# EAGLE design pio (EAGLE 9.0.1)
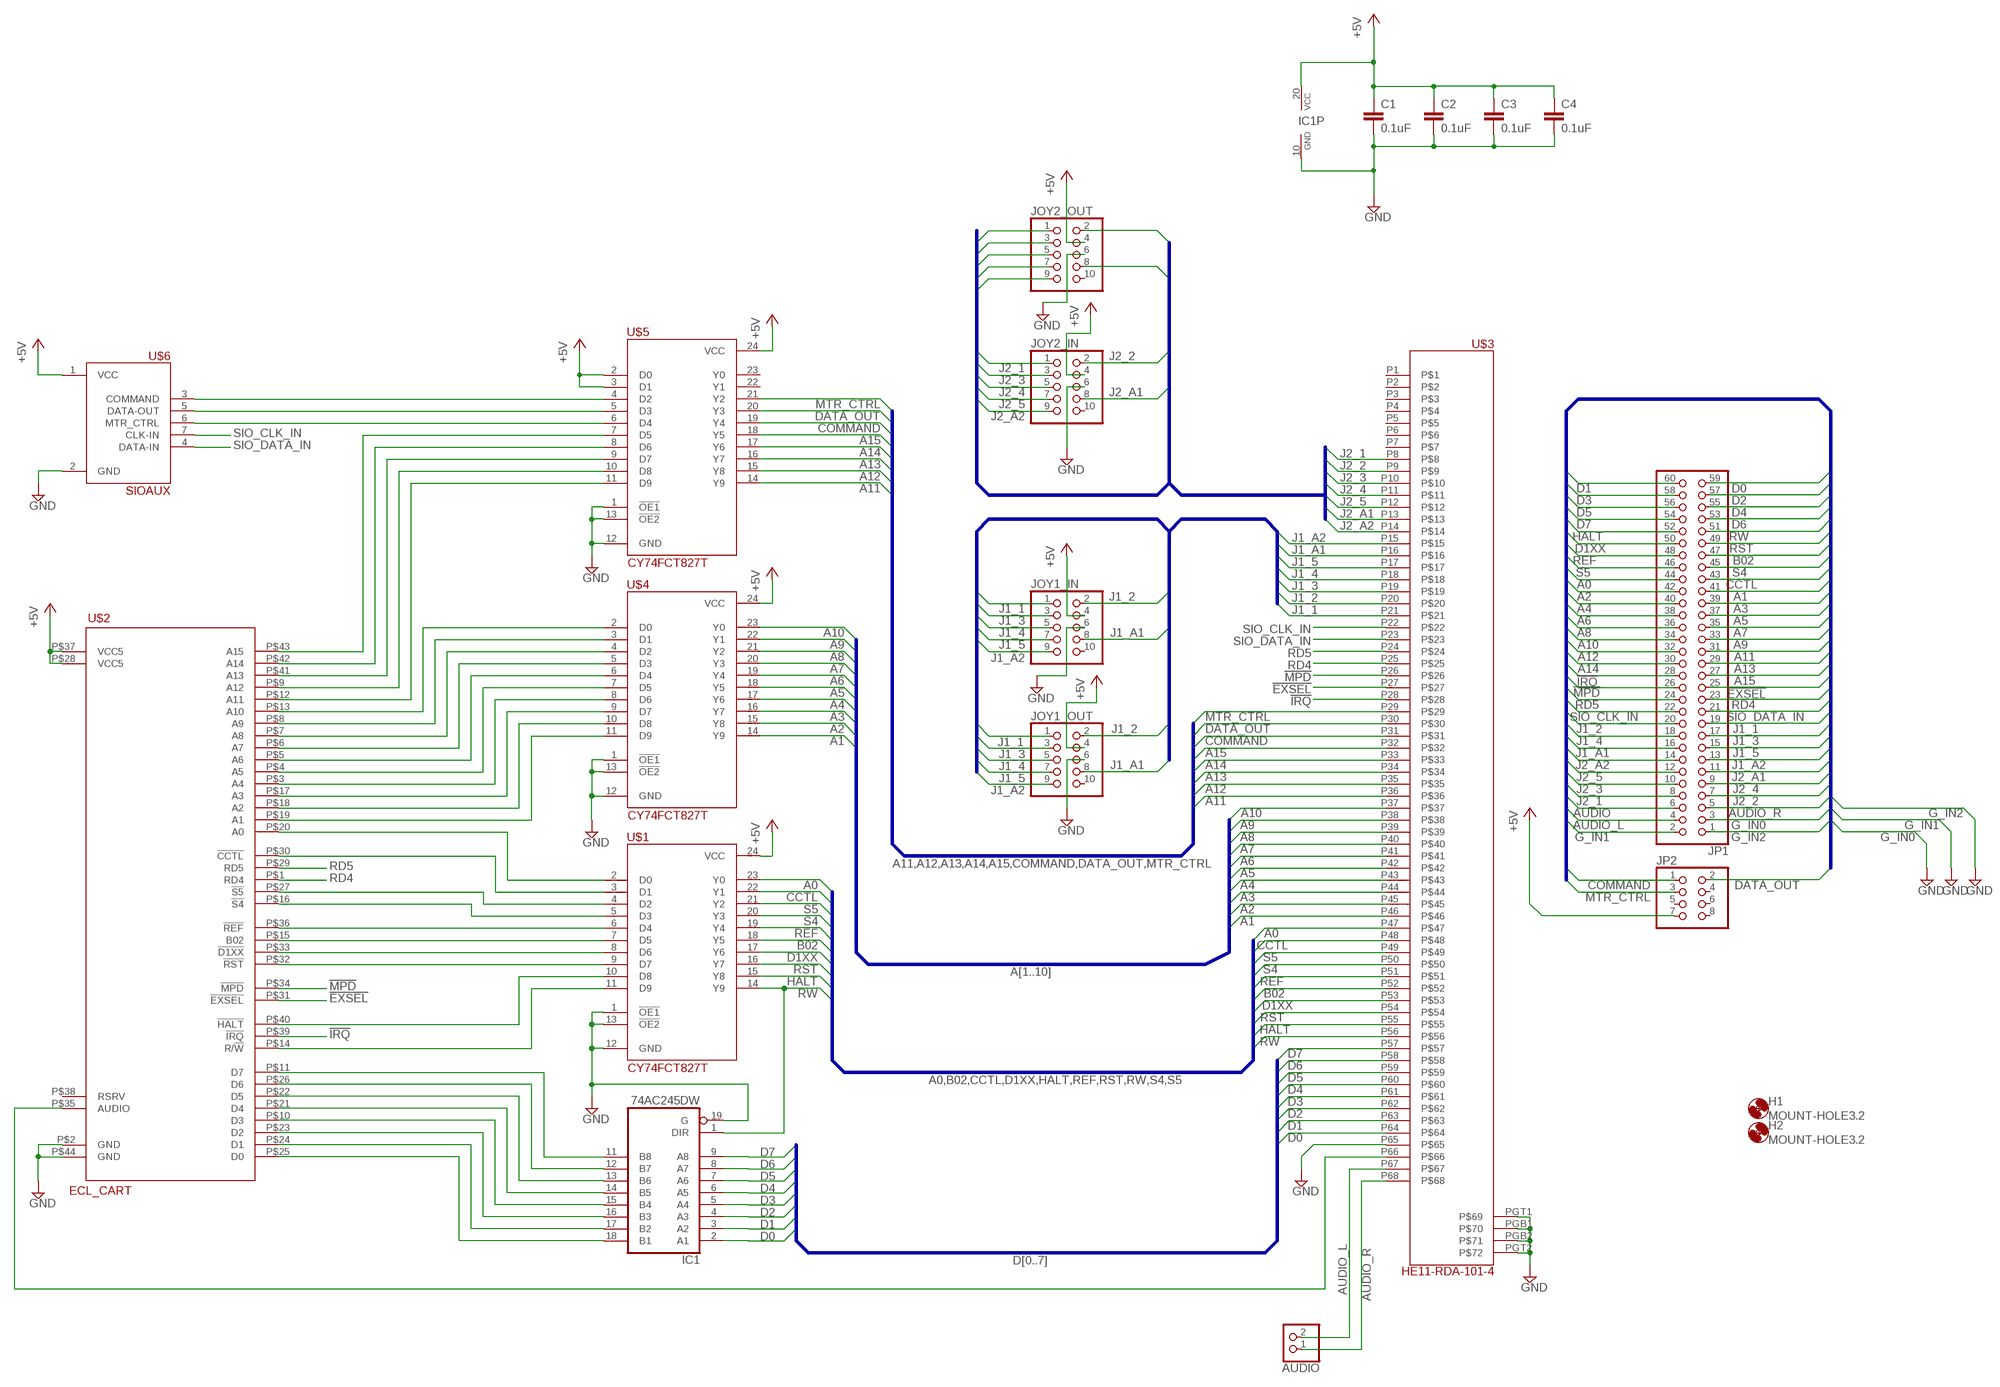
[diagram p0: schematic, sheet 1]

## Parts
AUDIO  PINHD-1X2  [1X02]
C1  0.1uF  C-EUC1206  [C1206]
C2  0.1uF  C-EUC1206  [C1206]
C3  0.1uF  C-EUC1206  [C1206]
C4  0.1uF  C-EUC1206  [C1206]
H1  MOUNT-HOLE3.2  [3,2]
H2  MOUNT-HOLE3.2  [3,2]
IC1  74AC245DW  [SO20W]
JOY1_IN  PINHD-2X5  [2X05]
JOY1_OUT  PINHD-2X5  [2X05]
JOY2_IN  PINHD-2X5  [2X05]
JOY2_OUT  PINHD-2X5  [2X05]
JP1  PINHD-2X30  [2X30]
JP2  PINHD-2X4  [2X04]
U$1  CY74FCT827T  [SO24L]
U$2  ECL_CART  [ECL_CART]
U$3  HE11-RDA-101-4  [HE11-RDA-101-4]
U$4  CY74FCT827T  [SO24L]
U$5  CY74FCT827T  [SO24L]
U$6  SIOAUX  [1X07]

## Nets
!EXSEL!: JP1.25 U$2.P$31(!EXSEL!) U$3.P27
!IRQ!: JP1.28 U$2.P$39(!IRQ!) U$3.P28
!MPD!: JP1.26 U$2.P$34(!MPD!) U$3.P26
+5V: C1.1 C2.1 C3.1 C4.1 IC1.20(VCC) JOY1_IN.4 JOY1_OUT.4 JOY2_IN.4 JOY2_OUT.4 JP2.7 U$1.24(VCC) U$2.P$28(VCC5) U$2.P$37(VCC5) U$4.24(VCC) U$5.2(D0) U$5.3(D1) U$5.24(VCC) U$6.1(VCC)
A0: JP1.44 U$1.23(Y0) U$3.P47
A1: JP1.41 U$3.P46 U$4.14(Y9)
A2: JP1.42 U$3.P45 U$4.15(Y8)
A3: JP1.39 U$3.P44 U$4.16(Y7)
A4: JP1.40 U$3.P43 U$4.17(Y6)
A5: JP1.37 U$3.P42 U$4.18(Y5)
A6: JP1.38 U$3.P41 U$4.19(Y4)
A7: JP1.35 U$3.P40 U$4.20(Y3)
A8: JP1.36 U$3.P39 U$4.21(Y2)
A9: JP1.33 U$3.P38 U$4.22(Y1)
A10: JP1.34 U$3.P37 U$4.23(Y0)
A11: JP1.31 U$3.P36 U$5.14(Y9)
A12: JP1.32 U$3.P35 U$5.15(Y8)
A13: JP1.29 U$3.P34 U$5.16(Y7)
A14: JP1.30 U$3.P33 U$5.17(Y6)
A15: JP1.27 U$3.P32 U$5.18(Y5)
AUDIO: JP1.6 U$2.P$35(AUDIO) U$3.P66
AUDIO_L: AUDIO.2 JP1.4 U$3.P67
AUDIO_R: AUDIO.1 JP1.5 U$3.P68
B02: JP1.47 U$1.18(Y5) U$3.P52
CCTL: JP1.43 U$1.22(Y1) U$3.P48
COMMAND: JP2.1 U$3.P31 U$5.19(Y4)
D0: IC1.2(A1) JP1.59 U$3.P64
D1: IC1.3(A2) JP1.60 U$3.P63
D1XX: JP1.50 U$1.17(Y6) U$3.P53
D2: IC1.4(A3) JP1.57 U$3.P62
D3: IC1.5(A4) JP1.58 U$3.P61
D4: IC1.6(A5) JP1.55 U$3.P60
D5: IC1.7(A6) JP1.56 U$3.P59
D6: IC1.8(A7) JP1.53 U$3.P58
D7: IC1.9(A8) JP1.54 U$3.P57
DATA_OUT: JP2.2 U$3.P30 U$5.20(Y3)
G_IN0: JP1.3 ; supply symbol labelled GND
G_IN1: JP1.2 ; supply symbol labelled GND
G_IN2: JP1.1 ; supply symbol labelled GND
GND: C1.2 C2.2 C3.2 C4.2 IC1.10(GND) IC1.19(G) JOY1_IN.6 JOY1_OUT.6 JOY2_IN.6 JOY2_OUT.6 U$1.1(!OE1!) U$1.12(GND) U$1.13(!OE2!) U$2.P$2(GND) U$2.P$44(GND) U$3.P65 U$3.PGB1 U$3.PGB2 U$3.PGT1 U$3.PGT2 U$4.1(!OE1!) U$4.12(GND) U$4.13(!OE2!) U$5.1(!OE1!) U$5.12(GND) U$5.13(!OE2!) U$6.2(GND)
HALT: JP1.52 U$1.15(Y8) U$3.P55
J1_1: JOY1_IN.1 JOY1_OUT.1 JP1.19 U$3.P21
J1_2: JOY1_IN.2 JOY1_OUT.2 JP1.20 U$3.P20
J1_3: JOY1_IN.3 JOY1_OUT.3 JP1.17 U$3.P19
J1_4: JOY1_IN.5 JOY1_OUT.5 JP1.18 U$3.P18
J1_5: JOY1_IN.7 JOY1_OUT.7 JP1.15 U$3.P17
J1_A1: JOY1_IN.8 JOY1_OUT.8 JP1.16 U$3.P16
J1_A2: JOY1_IN.9 JOY1_OUT.9 JP1.13 U$3.P15
J2_1: JOY2_IN.1 JOY2_OUT.1 JP1.8 U$3.P8
J2_2: JOY2_IN.2 JOY2_OUT.2 JP1.7 U$3.P9
J2_3: JOY2_IN.3 JOY2_OUT.3 JP1.10 U$3.P10
J2_4: JOY2_IN.5 JOY2_OUT.5 JP1.9 U$3.P11
J2_5: JOY2_IN.7 JOY2_OUT.7 JP1.12 U$3.P12
J2_A1: JOY2_IN.8 JOY2_OUT.8 JP1.11 U$3.P13
J2_A2: JOY2_IN.9 JOY2_OUT.9 JP1.14 U$3.P14
MTR_CTRL: JP2.3 U$3.P29 U$5.21(Y2)
N$1: U$1.11(D9) U$2.P$14(R/!W!)
N$3: U$1.10(D8) U$2.P$40(!HALT!)
N$4: U$1.9(D7) U$2.P$32(!RST!)
N$5: U$1.8(D6) U$2.P$33(!D1XX!)
N$6: U$1.7(D5) U$2.P$15(B02)
N$7: U$1.6(D4) U$2.P$36(!REF!)
N$8: U$1.5(D3) U$2.P$16(!S4!)
N$9: U$1.4(D2) U$2.P$27(!S5!)
N$10: U$1.3(D1) U$2.P$30(!CCTL!)
N$11: U$1.2(D0) U$2.P$20(A0)
N$22: U$2.P$19(A1) U$4.11(D9)
N$23: U$2.P$18(A2) U$4.10(D8)
N$24: U$2.P$17(A3) U$4.9(D7)
N$25: U$2.P$3(A4) U$4.8(D6)
N$26: U$2.P$4(A5) U$4.7(D5)
N$27: U$2.P$5(A6) U$4.6(D4)
N$28: U$2.P$6(A7) U$4.5(D3)
N$29: U$2.P$7(A8) U$4.4(D2)
N$30: U$2.P$8(A9) U$4.3(D1)
N$31: U$2.P$13(A10) U$4.2(D0)
N$42: U$5.6(D4) U$6.6(MTR_CTRL)
N$43: U$5.5(D3) U$6.5(DATA-OUT)
N$44: U$5.4(D2) U$6.3(COMMAND)
N$45: U$2.P$12(A11) U$5.11(D9)
N$46: U$2.P$9(A12) U$5.10(D8)
N$47: U$2.P$41(A13) U$5.9(D7)
N$48: U$2.P$42(A14) U$5.8(D6)
N$49: U$2.P$43(A15) U$5.7(D5)
N$67: IC1.11(B8) U$2.P$11(D7)
N$68: IC1.12(B7) U$2.P$26(D6)
N$69: IC1.13(B6) U$2.P$22(D5)
N$70: IC1.14(B5) U$2.P$21(D4)
N$71: IC1.15(B4) U$2.P$10(D3)
N$72: IC1.16(B3) U$2.P$23(D2)
N$73: IC1.17(B2) U$2.P$24(D1)
N$74: IC1.18(B1) U$2.P$25(D0)
RD4: JP1.23 U$2.P$1(RD4) U$3.P25
RD5: JP1.24 U$2.P$29(RD5) U$3.P24
REF: JP1.48 U$1.19(Y4) U$3.P51
RST: JP1.49 U$1.16(Y7) U$3.P54
RW: IC1.1(DIR) JP1.51 U$1.14(Y9) U$3.P56
S4: JP1.45 U$1.20(Y3) U$3.P50
S5: JP1.46 U$1.21(Y2) U$3.P49
SIO_CLK_IN: JP1.22 U$3.P22 U$6.7(CLK-IN)
SIO_DATA_IN: JP1.21 U$3.P23 U$6.4(DATA-IN)
Unconnected: JOY1_IN.10 JOY1_OUT.10 JOY2_IN.10 JOY2_OUT.10 JP2.4 JP2.5 JP2.6 JP2.8 U$2.P$38(RSRV) U$3.P1 U$3.P2 U$3.P3 U$3.P4 U$3.P5 U$3.P6 U$3.P7 U$5.22(Y1) U$5.23(Y0)

## Buses
D[0..7]
A0,B02,CCTL,D1XX,HALT,REF,RST,RW,S4,S5
A[1..10]
A11,A12,A13,A14,A15,COMMAND,DATA_OUT,MTR_CTRL
J1_1,J1_2,J1_3,J1_4,J1_5,J1_A1,J1_A2
J2_1,J2_2,J2_3,J2_4,J2_5,J2_A1,J2_A2
!EXSEL!,!IRQ!,!MPD!,+5V,A0,A1,A10,A11,A12,A13,A14,A15,A2,A3,A4,A5,A6,A7,A8,A9,AUDIO,AUDIO_L,AUDIO_R,B02,CCTL,COMMAND,D0,D1,D1XX,D2,D3,D4,D5,D6,D7,DATA_OUT,GND,G_IN0,G_IN1,G_IN2,G_OUT0,G_OUT1,G_OUT2,G_OUT3,HALT,J1_1,J1_2,J1_3,J1_4,J1_5,J1_A1,J1_A2,J2_1,J2_2,J2_3,J2_4,J2_5,J2_A1,J2_A2,MTR_CTRL,RD4,RD5,REF,RST,RW,S4,S5,SIO_CLK_IN,SIO_DATA_IN

## Library data of the parts
AUDIO = pinhead:PINHD-1X2: PIN HEADER
C1-C4 = rcl:C-EU: CAPACITOR, European symbol; SPICEPREFIX: C
H1 H2 = holes:MOUNT-HOLE: MOUNTING HOLE with drill center marker
IC1 = 74xx-eu:74*245: Octal BUS TRANSCEIVER, 3-state
JOY1_IN JOY1_OUT JOY2_IN JOY2_OUT = pinhead:PINHD-2X5: PIN HEADER
JP1 = pinhead:PINHD-2X30: PIN HEADER
JP2 = pinhead:PINHD-2X4: PIN HEADER
U$1 U$4 U$5 = sjg-logic:CY74FCT827T
U$2 = Atari:ECL_CART
U$3 = sjg-vhdci:HE11-RDA-101-4
U$6 = pbxl:SIOAUX

## Board
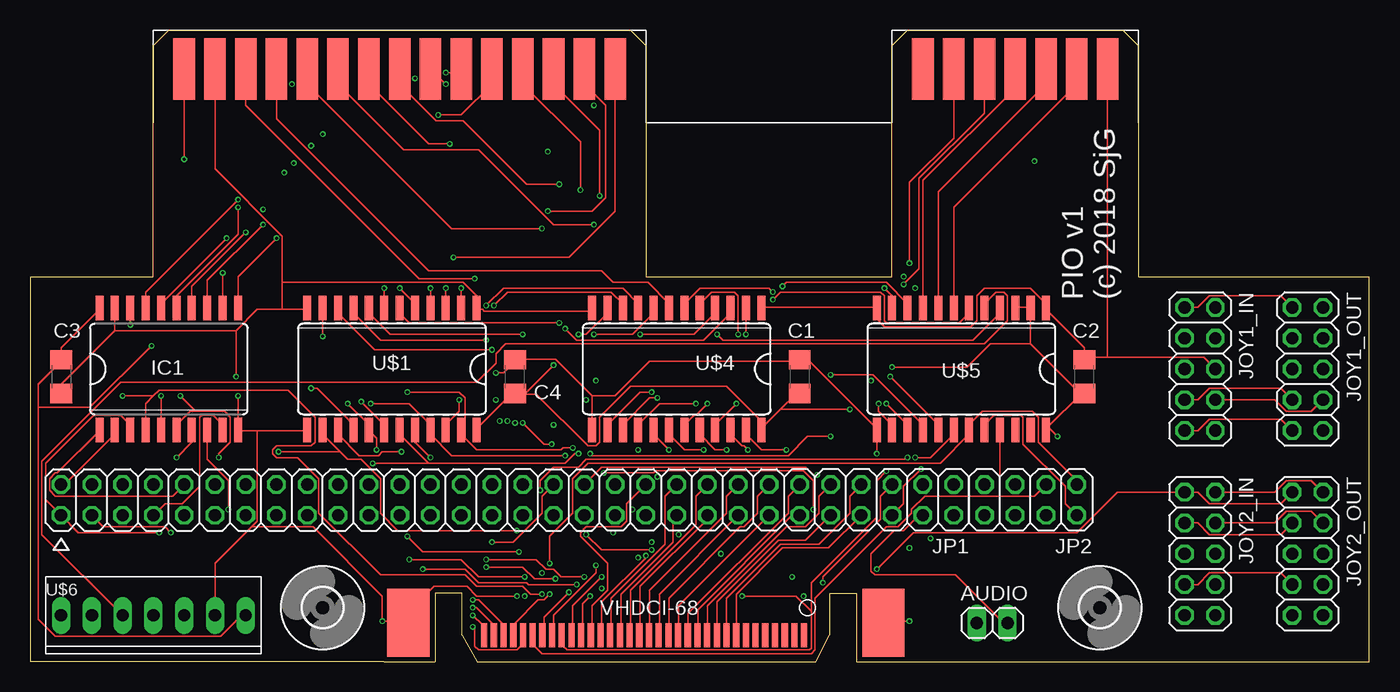
[diagram p1: board, top side]
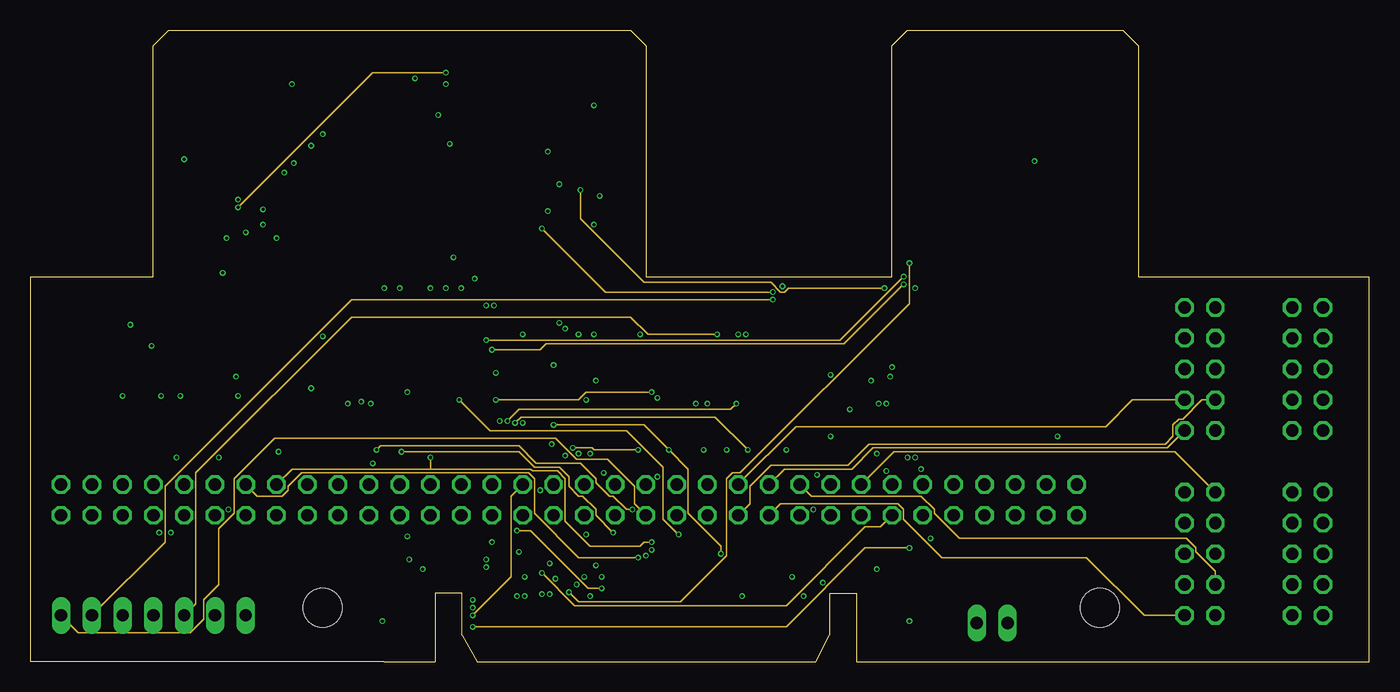
[diagram p2: board, inner layer Route2]
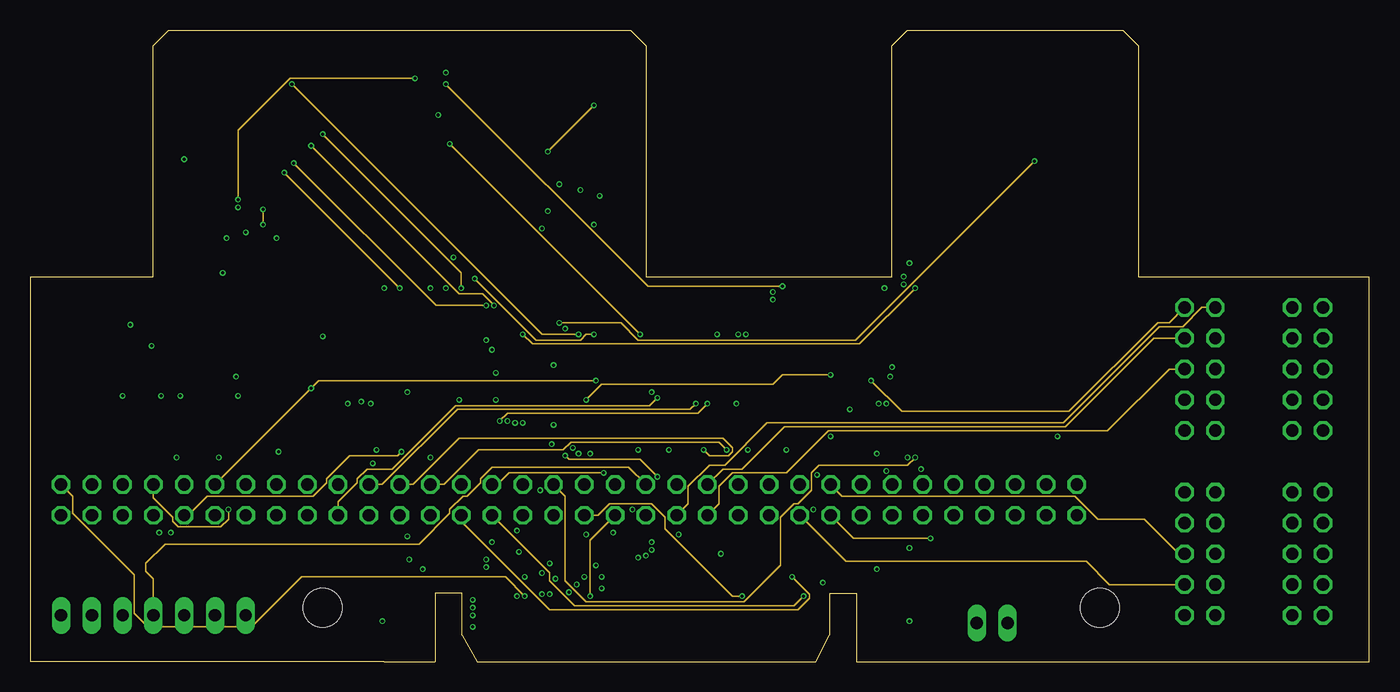
[diagram p3: board, inner layer Route15]
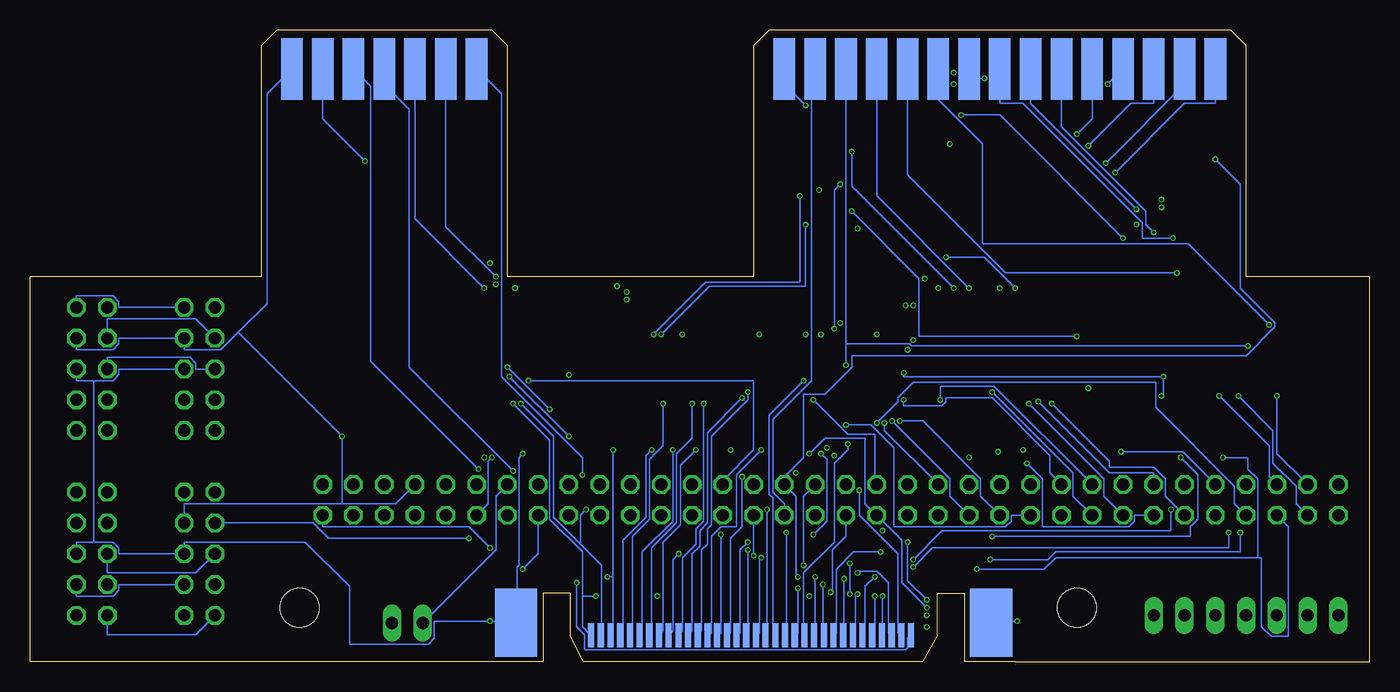
[diagram p4: board, bottom side, seen from below]

Size 110.49 x 52.07 mm. Coordinates in mm from the lower left corner, seen from the top.
Outline: 72.39,0 110.49,0 110.49,31.75 91.44,31.75 91.44,50.8 90.17,52.07 72.39,52.07 71.12,50.8 71.12,31.75 50.8,31.75 50.8,50.8 49.53,52.07 11.43,52.07 10.16,50.8 10.16,31.75 0,31.75 0,0 29.21,0
Copper layers (1*2*15*16): Top 0.035559375mm / dielectric 0.17018125mm / Route2 0.01778125mm / dielectric 47mil / Route15 0.01778125mm / dielectric 0.17018125mm / Bottom 0.035559375mm
Design rules "oshpark-4layer": minimum track width 5mil, minimum drill 10mil, track to track 5mil, track to pad 5mil, pad to pad 5mil, via to via 5mil, smd to smd 5mil, copper to edge 15mil, drill to drill 6mil, minimum pad ring 4mil, minimum via ring 4mil, stop-mask expansion 2.5mil, vias tented up to drill 0mil, thermal gap 10mil
vRestrict: area 36.8,2.5 to 64.8,5.1; area 35.6,0 to 66,2.5; area 5.1,17.1 to 17.8,21.6; area 4.4,28.6 to 17.8,31.8; area 22.2,27.3 to 36.8,30.5; area 22.2,17.8 to 37.5,21; area 45.7,17.8 to 61,21; area 45.1,27.3 to 61,30.5; area 69.2,17.8 to 84.5,21; area 69.2,27.3 to 84.5,30.5; area 85.7,20.3 to 88.9,26.7; area 62.2,20.3 to 65.4,26.7; 2 more areas

### Footprints (pad centres in the part's own frame; a part is rotated, then mirrored left to right if it is on the bottom)
1X02 = drill 1.016 long: 1 -1.27,0; 2 1.27,0
C1206 = smd 1.6 x 1.8: 1 -1.4,0; 2 1.4,0
3,2 = hole 3.2: 0,0
SO20W = smd 0.66 x 2.032: 1 -5.715,-5.029; 2 -4.445,-5.029; 3 -3.175,-5.029; 4 -1.905,-5.029; 5 -0.635,-5.029; 6 0.635,-5.029; 7 1.905,-5.029; 8 3.175,-5.029; 9 4.445,-5.029; 10 5.715,-5.029; 11 5.715,5.029; 12 4.445,5.029; 13 3.175,5.029; 14 1.905,5.029; 15 0.635,5.029; 16 -0.635,5.029; 17 -1.905,5.029; 18 -3.175,5.029; 19 -4.445,5.029; 20 -5.715,5.029
2X05 = drill 1.016 octagon: 1 -5.08,-1.27; 2 -5.08,1.27; 3 -2.54,-1.27; 4 -2.54,1.27; 5 0,-1.27; 6 0,1.27; 7 2.54,-1.27; 8 2.54,1.27; 9 5.08,-1.27; 10 5.08,1.27
2X30 = drill 1.016 octagon: 1 -38.1,-1.27; 2 -38.1,1.27; 3 -35.56,-1.27; 4 -35.56,1.27; 5 -33.02,-1.27; 6 -33.02,1.27; 7 -30.48,-1.27; 8 -30.48,1.27; 9 -27.94,-1.27; 10 -27.94,1.27; 11 -25.4,-1.27; 12 -25.4,1.27; 13 -22.86,-1.27; 14 -22.86,1.27; 15 -20.32,-1.27; 16 -20.32,1.27; 17 -17.78,-1.27; 18 -17.78,1.27; 19 -15.24,-1.27; 20 -15.24,1.27; 21 -12.7,-1.27; 22 -12.7,1.27; 23 -10.16,-1.27; 24 -10.16,1.27; 25 -7.62,-1.27; 26 -7.62,1.27; 27 -5.08,-1.27; 28 -5.08,1.27; 29 -2.54,-1.27; 30 -2.54,1.27; 31 0,-1.27; 32 0,1.27; 33 2.54,-1.27; 34 2.54,1.27; 35 5.08,-1.27; 36 5.08,1.27; 37 7.62,-1.27; 38 7.62,1.27; 39 10.16,-1.27; 40 10.16,1.27; 41 12.7,-1.27; 42 12.7,1.27; 43 15.24,-1.27; 44 15.24,1.27; 45 17.78,-1.27; 46 17.78,1.27; 47 20.32,-1.27; 48 20.32,1.27; 49 22.86,-1.27; 50 22.86,1.27; 51 25.4,-1.27; 52 25.4,1.27; 53 27.94,-1.27; 54 27.94,1.27; 55 30.48,-1.27; 56 30.48,1.27; 57 33.02,-1.27; 58 33.02,1.27; 59 35.56,-1.27; 60 35.56,1.27
2X04 = drill 1.016 octagon: 1 -3.81,-1.27; 2 -3.81,1.27; 3 -1.27,-1.27; 4 -1.27,1.27; 5 1.27,-1.27; 6 1.27,1.27; 7 3.81,-1.27; 8 3.81,1.27
SO24L = smd 0.66 x 2.032: 1 -6.985,-5.029; 2 -5.715,-5.029; 3 -4.445,-5.029; 4 -3.175,-5.029; 5 -1.905,-5.029; 6 -0.635,-5.029; 7 0.635,-5.029; 8 1.905,-5.029; 9 3.175,-5.029; 10 4.445,-5.029; 11 5.715,-5.029; 12 6.985,-5.029; 13 6.985,5.029; 14 5.715,5.029; 15 4.445,5.029; 16 3.175,5.029; 17 1.905,5.029; 18 0.635,5.029; 19 -0.635,5.029; 20 -1.905,5.029; 21 -3.175,5.029; 22 -4.445,5.029; 23 -5.715,5.029; 24 -6.985,5.029
ECL_CART = smd 1.778 x 5.08: P$1 2.54,4.445; P$2 5.08,4.445; P$3 7.62,4.445; P$4 10.16,4.445; P$5 12.7,4.445; P$6 15.24,4.445; P$7 17.78,4.445; P$8 20.32,4.445; P$9 22.86,4.445; P$10 25.4,4.445; P$11 27.94,4.445; P$12 30.48,4.445; P$13 33.02,4.445; P$14 35.56,4.445; P$15 38.1,4.445; P$38 63.5,4.445; P$39 66.04,4.445; P$40 68.58,4.445; P$41 71.12,4.445; P$42 73.66,4.445; P$43 76.2,4.445; P$44 78.74,4.445 | smd 1.778 x 5.08 bottom: P$16 2.54,4.445; P$17 5.08,4.445; P$18 7.62,4.445; P$19 10.16,4.445; P$20 12.7,4.445; P$21 15.24,4.445; P$22 17.78,4.445; P$23 20.32,4.445; P$24 22.86,4.445; P$25 25.4,4.445; P$26 27.94,4.445; P$27 30.48,4.445; P$28 33.02,4.445; P$29 35.56,4.445; P$30 38.1,4.445; P$31 63.5,4.445; P$32 66.04,4.445; P$33 68.58,4.445; P$34 71.12,4.445; P$35 73.66,4.445; P$36 76.2,4.445; P$37 78.74,4.445
HE11-RDA-101-4 = smd 0.508 x 2.007: P1 13.054,2.17; P2 12.254,2.17; P3 11.454,2.17; P4 10.654,2.17; P5 9.854,2.17; P6 9.054,2.17; P7 8.254,2.17; P8 7.454,2.17; P9 6.654,2.17; P10 5.854,2.17; P11 5.054,2.17; P12 4.254,2.17; P13 3.454,2.17; P14 2.654,2.17; P15 1.854,2.17; P16 1.054,2.17; P17 0.254,2.17; P18 -0.546,2.17; P19 -1.346,2.17; P20 -2.146,2.17; P21 -2.946,2.17; P22 -3.746,2.17; P23 -4.546,2.17; P24 -5.346,2.17; P25 -6.146,2.17; P26 -6.946,2.17; P27 -7.746,2.17; P28 -8.546,2.17; P29 -9.346,2.17; P30 -10.146,2.17; P31 -10.946,2.17; P32 -11.746,2.17; P33 -12.546,2.17; P34 -13.346,2.17 | smd 0.508 x 2.007 bottom: P35 13.409,2.17; P36 12.609,2.17; P37 11.809,2.17; P38 11.009,2.17; P39 10.209,2.17; P40 9.409,2.17; P41 8.609,2.17; P42 7.809,2.17; P43 7.009,2.17; P44 6.209,2.17; P45 5.409,2.17; P46 4.609,2.17; P47 3.809,2.17; P48 3.009,2.17; P49 2.209,2.17; P50 1.409,2.17; P51 0.609,2.17; P52 -0.191,2.17; P53 -0.991,2.17; P54 -1.791,2.17; P55 -2.591,2.17; P56 -3.391,2.17; P57 -4.191,2.17; P58 -4.991,2.17; P59 -5.791,2.17; P60 -6.591,2.17; P61 -7.391,2.17; P62 -8.191,2.17; P63 -8.991,2.17; P64 -9.791,2.17; P65 -10.591,2.17; P66 -11.391,2.17; P67 -12.191,2.17; P68 -12.991,2.17 | smd 3.48 x 5.639 bottom: PGB1 19.6,3.2; PGB2 -19.6,3.2 | smd 3.48 x 5.639: PGT1 19.6,3.2; PGT2 -19.6,3.2
1X07 = drill 1.016 long: 1 -7.62,0; 2 -5.08,0; 3 -2.54,0; 4 0,0; 5 2.54,0; 6 5.08,0; 7 7.62,0

### Placement (x,y rotation side)
AUDIO  79.38,3.17 0 top
C1  63.5,23.5 90 top
C2  87,23.5 90 top
C3  2.54,23.5 270 top
C4  40.01,23.5 90 top
H1  88.27,4.45 90 top
H2  24.13,4.45 90 top
IC1  11.43,24.13 0 top
JOY1_IN  96.52,24.13 270 top
JOY1_OUT  105.41,24.13 270 top
JOY2_IN  96.52,8.89 270 top
JOY2_OUT  105.41,8.89 270 top
JP1  38.1,13.34 180 top
JP2  82.55,13.34 180 top
U$1  29.84,24.13 180 top
U$2  10.16,44.45 0 top
U$3  50.8,0 0 top
U$4  53.34,24.13 180 top
U$5  76.83,24.13 180 top
U$6  10.16,3.81 180 top

### Tracks (layer width: path | path; a pad name or v marks a point on that pad's centre or on a via)
!EXSEL!  (via drill 0.25)
  Top 0.127: v46.67,7.94 46.67,7.3 43.18,3.81 43.18,2.22 U$3.P27 | v64.93,15.4 64.61,15.4 63.98,16.03 47.15,16.03 JP1.25
  Bottom 0.127: v46.67,7.94 46.67,13.65 JP1.25 | U$2.P$31 71.6,46.83 71.6,23.5 64.93,16.83 v64.93,15.4
!IRQ!  (via drill 0.25)
  Top 0.127: v44.45,5.71 42.39,3.65 42.39,2.22 U$3.P28 | U$2.P$39 76.2,43.18 72.55,39.53 v72.55,32.86
  Route2 0.127: v72.55,32.86 72.55,29.53 58.58,15.56 57.94,15.56 57.47,15.08 57.47,8.73 53.66,4.92 45.24,4.92 v44.45,5.71
  Bottom 0.127: v44.45,5.71 44.29,5.87 44.29,9.21 43.18,10.32 JP1.28
!MPD!  (via drill 0.25)
  Top 0.127: 64.45,4.13 64.45,6.51 69.85,11.91 69.85,14.92 v70.64,15.72 | 64.45,4.13 64.45,1.11 64.29,0.95 44.29,0.95 43.97,1.27 43.97,2.06 U$3.P26 | v58.74,5.4 63.18,5.4 64.45,4.13
  Route15 0.127: JP1.26 46.83,12.06 47.78,13.02 51.28,13.02 52.39,11.91 52.39,10.95 57.94,5.4 v58.74,5.4
  Bottom 0.127: v70.64,15.72 79.22,24.29 79.22,45.56 81.28,47.62 U$2.P$34
+5V  (via drill 0.25)
  Top 0.127: U$5.3 81.28,29.21 82.55,29.21 U$5.2 82.55,29.05 82.55,26.19 | 86.68,22.07 87,22.07 C2.1 86.68,22.07 | 83.98,19.37 83.82,19.21 U$5.24 83.98,19.37 | 83.98,19.37 86.68,22.07 | 86.68,22.07 82.55,26.19 | JOY2_IN.4 102.71,11.43 103.66,12.38 105.73,12.38 JOY2_OUT.4 | v84.77,18.57 83.98,19.37 | IC1.20 5.71,29.05 2.54,25.88 2.54,24.92 C3.1 2.54,24.77 0.64,22.86 0.64,20.95 | U$6.1 17.46,3.81 15.72,2.06 2.06,2.06 0.64,3.49 0.64,20.95 | 40.01,22.07 39.69,22.07 36.83,19.21 U$1.24 | 40.01,22.07 C4.1 | 60.64,19.53 60.33,19.21 U$4.24 60.64,19.53 | 60.64,19.53 61.91,20.8 | 61.91,20.8 63.18,22.07 63.5,22.07 C1.1 | 40.8,22.07 41.75,22.07 46.04,17.78 46.67,17.78 46.99,18.1 46.99,20.16 49.53,22.7 57.47,22.7 60.64,19.53 | 40.8,22.07 40.01,22.07 | 40.01,22.07 C4.1 | 40.8,22.07 v43.18,24.45 | 40.8,22.07 C4.1 | 0.64,20.95 4.92,20.95 v10,26.04 | 82.55,26.19 79.22,26.19 77.31,24.29 v71.12,24.29 | 61.91,20.8 v67.63,20.8
  Bottom 0.127: JOY1_OUT.4 106.68,25.72 103.66,25.72 103.19,26.19 103.19,26.67 JOY1_IN.4 97.79,25.72 94.77,25.72 93.34,27.15 | U$2.P$37 90.96,46.83 90.96,29.53 93.34,27.15 | JP2.7 80.33,13.02 84.77,13.02 | 84.77,13.02 97.79,13.02 JOY2_IN.4 | 84.77,13.02 v84.77,18.57 93.34,27.15 | v43.18,24.45 43.18,26.19 | 43.18,26.19 U$2.P$28 | v10,26.04 37.78,26.04 37.94,26.19 43.18,26.19 | v67.63,20.8 v71.12,24.29
A0  (via drill 0.25)
  Top 0.127: v44.77,17.62 43.97,17.62 43.81,17.46 36.83,17.46 35.88,18.41 | 35.88,18.41 35.56,18.73 35.56,19.05 U$1.23 35.88,18.41 | v31.11,22.23 35.4,22.23 35.88,21.75 35.88,18.41
  Route2 0.127: v50.16,17.46 46.51,17.46 46.35,17.62 v44.77,17.62
  Bottom 0.127: v50.16,17.46 52.23,15.4 52.23,11.11 53.5,11.11 54.29,10.32 54.29,2.38 54.45,2.22 U$3.P47 | JP1.44 24.45,13.65 24.45,15.56 v31.11,22.23
A1  (via drill 0.25)
  Top 0.127: v51.28,22.23 50.32,22.23 47.62,19.53 47.62,19.21 U$4.14
  Route2 0.127: v38.42,21.59 45.24,21.59 45.88,22.23 v51.28,22.23
  Bottom 0.127: v51.28,22.23 51.28,21.59 54.29,18.57 54.29,11.27 54.61,10.95 54.61,9.68 55.09,9.21 55.09,2.54 55.4,2.22 U$3.P46 | JP1.41 26.35,15.56 26.35,16.99 31.11,21.75 34.92,21.75 34.92,21.43 35.24,21.11 38.42,21.11 v38.42,21.59
A2  (via drill 0.25)
  Top 0.127: v51.75,21.75 51.12,21.75 48.9,19.53 48.9,19.21 U$4.15
  Route15 0.127: JP1.42 25.4,13.18 26.99,14.76 26.99,15.08 27.78,15.88 29.84,15.88 35.08,21.11 51.12,21.11 v51.75,21.75
  Bottom 0.127: v51.75,21.75 54.61,18.89 54.61,11.43 55.24,10.79 55.24,9.53 55.88,8.89 55.88,2.54 56.2,2.22 U$3.P45
A3  (via drill 0.25)
  Top 0.127: v54.93,21.27 51.91,21.27 50.16,19.53 50.16,19.21 U$4.16
  Route15 0.127: JP1.39 29.05,14.61 35.24,20.8 54.45,20.8 v54.93,21.27
  Bottom 0.127: v54.93,21.27 54.93,11.59 55.56,10.95 55.56,9.68 56.67,8.57 56.67,2.54 56.99,2.22 U$3.P44
A4  (via drill 0.25)
  Top 0.127: v52.7,17.46 51.44,18.73 51.44,19.05 U$4.17
  Route2 0.127: v56.99,8.89 56.99,9.53 54.29,12.22 54.29,15.88 v52.7,17.46 50.64,19.53 v43.18,19.53
  Bottom 0.127: v56.99,8.89 57.47,8.41 57.47,2.54 57.78,2.22 U$3.P43 | JP1.40 29.53,12.06 29.53,11.59 30,11.11 39.21,11.11 39.21,17.62 41.12,19.53 v43.18,19.53
A5  (via drill 0.25)
  Top 0.127: v55.56,17.46 53.98,17.46 52.7,18.73 52.7,19.05 U$4.18
  Route15 0.127: JP1.37 31.59,14.61 35.4,18.41 57.15,18.41 57.94,17.62 57.94,17.3 57.63,16.99 56.04,16.99 v55.56,17.46
  Bottom 0.127: v55.56,17.46 56.83,16.19 56.83,11.27 58.26,9.84 58.26,2.54 58.58,2.22 U$3.P42
A6  (via drill 0.25)
  Top 0.127: v55.88,21.27 54.93,20.32 54.77,20.32 53.98,19.53 53.98,19.21 U$4.19
  Route15 0.127: v38.73,19.84 39.37,20.48 55.09,20.48 v55.88,21.27
  Bottom 0.127: v55.88,21.27 55.88,18.41 57.15,17.14 57.15,11.43 59.21,9.37 59.21,2.38 59.37,2.22 U$3.P41 | JP1.38 32.07,13.65 32.07,15.08 36.83,19.84 v38.73,19.84
A7  (via drill 0.25)
  Top 0.127: v57.47,17.46 56.52,17.46 55.24,18.73 55.24,19.05 U$4.20
  Route15 0.127: JP1.35 34.13,14.61 36.99,17.46 43.97,17.46 44.61,18.1 56.83,18.1 v57.47,17.46
  Bottom 0.127: v57.47,17.46 57.47,11.59 60.01,9.05 60.01,2.38 60.17,2.22 U$3.P40
A8  (via drill 0.25)
  Top 0.127: v58.26,21.27 56.52,19.53 56.52,19.21 U$4.21
  Route2 0.127: v39.37,19.84 40.32,20.8 57.78,20.8 v58.26,21.27
  Bottom 0.127: v58.26,21.27 58.26,17.78 59.37,16.67 59.37,11.75 60.8,10.32 60.8,2.38 60.96,2.22 U$3.P39 | JP1.36 34.61,13.65 34.61,15.08 v39.37,19.84
A9  (via drill 0.25)
  Top 0.127: v59.21,17.46 58.9,17.78 58.74,17.78 57.78,18.73 57.78,19.05 U$4.22
  Route2 0.127: v40.01,19.68 40.48,20.16 56.52,20.16 v59.21,17.46
  Bottom 0.127: v59.21,17.46 59.69,16.99 59.69,11.91 61.59,10 61.59,2.38 61.75,2.22 U$3.P38 | JP1.33 40.01,19.05 v40.01,19.68
A10  (via drill 0.25)
  Top 0.127: v62.39,17.46 60.33,17.46 59.05,18.73 59.05,19.05 U$4.23
  Route15 0.127: JP1.34 35.56,11.59 42.86,4.29 63.34,4.29 64.29,5.24 64.29,5.56 v62.87,6.99
  Bottom 0.127: v62.39,17.46 62.39,6.99 | 62.39,6.99 62.39,2.38 62.55,2.22 U$3.P37 | 62.39,6.99 v62.87,6.99
A11  (via drill 0.25)
  Top 0.127: v70.01,21.27 70.01,20.64 71.12,19.53 71.12,19.21 U$5.14 | v47.31,15.56 51.44,15.56 51.59,15.72 63.82,15.72 64.61,14.92 v64.61,12.54
  Route15 0.127: JP1.31 38.58,14.61 39.53,15.56 v47.31,15.56
  Bottom 0.127: 65.09,9.68 67.31,11.91 67.31,18.57 v70.01,21.27 | 65.09,9.68 63.34,7.94 63.34,2.22 U$3.P36 | v64.61,12.54 65.09,12.06 65.09,9.68
A12  (via drill 0.25)
  Top 0.127: v70.64,21.27 72.39,19.53 72.39,19.21 U$5.15
  Route15 0.127: JP1.32 42.86,7.3 42.86,6.67 44.93,4.6 63.02,4.6 v63.82,5.4
  Bottom 0.127: 64.93,5.4 64.93,9.05 67.63,11.75 67.63,18.26 v70.64,21.27 | 64.93,5.4 64.93,2.86 64.29,2.22 U$3.P35 | 64.93,5.4 v63.82,5.4
A13  (via drill 0.25)
  Top 0.127: v36.51,3.81 37.31,3.02 37.31,2.22 U$3.P34 | v66.04,23.65 69.53,23.65 73.66,19.53 73.66,19.21 U$5.16
  Route2 0.127: v36.51,3.81 39.69,6.99 39.69,13.65 JP1.29
  Route15 0.127: v66.04,23.65 62.07,23.65 61.28,22.86 47.15,22.86 v45.88,21.59
  Bottom 0.127: v45.88,21.59 43.02,18.73 40.8,18.73 40.8,14.76 JP1.29
A14  (via drill 0.25)
  Top 0.127: v36.51,4.45 36.83,4.45 38.1,3.17 38.1,2.22 U$3.P33 | v70.96,23.5 74.93,19.53 74.93,19.21 U$5.17 | v66.04,18.57 64.14,18.57 62.55,16.99 46.35,16.99 v46.2,17.14
  Bottom 0.127: v36.51,4.45 38.58,6.51 38.58,10 JP1.30 41.59,13.02 41.59,18.41 44.93,18.41 v46.2,17.14 | v66.04,18.57 v70.96,23.5
A15  (via drill 0.25)
  Top 0.127: v36.51,5.08 36.99,5.08 39.05,3.02 39.05,2.22 U$3.P32 | v38.1,9.84 39.85,9.84 42.23,12.22 42.23,13.65 JP1.27 | v73.03,16.83 74.3,16.83 76.2,18.73 76.2,19.05 U$5.18
  Route15 0.127: v73.03,16.83 72.39,16.19 65.09,16.19 64.45,15.56 64.45,14.13 63.34,13.02 63.02,13.02 61.91,11.91 61.91,7.94 58.9,4.92 45.88,4.92 44.13,6.67 44.13,13.65 JP1.27
  Bottom 0.127: v36.51,5.08 38.1,6.67 v38.1,9.84
AUDIO  (via drill 0.25)
  Top 0.127: v73.5,15.88 72.07,14.45 72.07,13.02 JP1.6
  Route2 0.127: v42.23,7.3 44.93,4.6 62.39,4.6 68.9,11.11 70.17,11.11 JP1.6
  Bottom 0.127: v42.23,7.3 42.23,7.46 40.64,7.46 39.69,6.51 39.69,2.38 39.53,2.22 U$3.P66 | U$2.P$35 82.39,47.47 82.39,24.77 v73.5,15.88
AUDIO_L  (via drill 0.25)
  Top 0.127: v42.07,14.13 42.07,14.92 43.18,16.03 45.24,16.03 45.88,16.67 72.23,16.67 v72.39,16.83 | AUDIO.2 80.33,3.17 76.36,7.14 69.69,7.14 69.37,7.46 69.37,8.89 71.28,10.79 72.07,10.79 73.34,12.06 JP1.4
  Bottom 0.127: v42.07,14.13 42.07,12.06 38.89,8.89 38.89,2.38 38.73,2.22 U$3.P67 | v72.39,16.83 72.71,16.51 72.71,13.02 JP1.4
AUDIO_R  (via drill 0.25)
  Top 0.127: v65.41,6.51 65.41,6.99 70.17,11.75 70.17,13.65 JP1.5
  Bottom 0.127: v65.41,6.51 65.41,2.86 64.77,2.22 64.77,0.95 38.26,0.95 38.1,1.11 38.1,1.91 37.94,2.06 U$3.P68 | AUDIO.1 72.07,9.21 72.07,13.65 JP1.5
B02  (via drill 0.25)
  Top 0.127: v27.3,21.43 29.21,19.53 29.21,19.21 U$1.18
  Route2 0.127: v50.16,8.57 45.24,8.57 41.59,12.22 41.59,15.08 41.12,15.56 22.38,15.56 21.27,14.45 21.27,14.13 20.8,13.65 18.73,13.65 JP1.47
  Bottom 0.127: v50.16,8.57 50.32,8.41 50.32,2.38 50.48,2.22 U$3.P52 | v27.3,21.43 21.43,15.56 17.78,15.56 JP1.47
CCTL  (via drill 0.25)
  Top 0.127: v35.4,21.59 35.4,20.64 34.29,19.53 34.29,19.21 U$1.22
  Route2 0.127: v53.5,10.48 52.23,11.75 52.23,16.03 49.21,19.05 37.94,19.05 v35.4,21.59
  Bottom 0.127: v53.5,10.48 53.5,2.38 53.66,2.22 U$3.P48 | JP1.43 30.96,22.7 35.4,22.7 v35.4,21.59
COMMAND  (via drill 0.25)
  Top 0.127: v42.86,5.56 42.39,5.08 41.91,5.08 40.01,3.17 40.01,2.22 U$3.P31 | v42.86,8.1 42.86,10.32 44.77,12.22 44.77,15.08 46.04,16.35 75.09,16.35 77.47,18.73 77.47,19.05 U$5.19 77.47,19.21 77.47,19.53 78.58,20.64 82.71,20.64 83.19,20.16 83.19,18.1 86.36,14.92 JP2.1
  Bottom 0.127: v42.86,8.1 v42.86,5.56
D0  (via drill 0.25)
  Top 0.127: JP1.59 2.86,14.61 6.99,18.73 6.99,19.05 IC1.2
  Route15 0.127: v40.8,5.4 39.21,6.99 22.38,6.99 18.26,2.86 9.68,2.86 8.57,3.97 8.57,7.14 3.49,12.22 3.49,13.65 JP1.59
  Bottom 0.127: v40.8,5.4 40.8,2.38 40.96,2.22 U$3.P64
D1  (via drill 0.25)
  Top 0.127: v40.8,6.99 36.99,6.99 35.56,8.41 v31.27,8.41 | v10.64,10.64 3.97,10.64 JP1.60 1.27,13.34 1.27,16.35 5.24,20.32 7.46,20.32 8.26,19.53 8.26,19.21 IC1.3
  Bottom 0.127: v40.8,6.99 41.59,6.19 41.59,2.38 41.75,2.22 U$3.P63 | v31.27,8.41 26.51,8.41 25.88,9.05 10.64,9.05 v10.64,10.64
D1XX  (via drill 0.25)
  Top 0.127: v28.57,17.46 28.57,18.41 27.94,19.05 U$1.17 27.94,19.21 27.94,19.53 v26.19,21.27
  Route2 0.127: v49.69,12.54 49.21,12.54 48.1,13.65 47.78,13.65 46.67,14.76 46.67,15.08 45.4,16.35 41.75,16.35 40.32,17.78 28.89,17.78 v28.57,17.46
  Bottom 0.127: v49.69,12.54 49.69,2.22 U$3.P53 | JP1.50 16.83,13.65 16.83,15.08 17.78,16.03 21.43,16.03 21.43,16.51 v26.19,21.27
D2  (via drill 0.25)
  Top 0.127: v42.23,5.56 41.27,5.56 40.64,6.19 36.83,6.19 35.88,7.14 28.89,7.14 23.81,12.22 23.81,15.08 22.07,16.83 20.32,16.83 20,17.14 20,17.46 20.32,17.78 23.18,17.78 23.5,18.1 23.5,20.16 21.27,22.38 10.64,22.38 10.16,21.91 | 10.16,21.91 9.53,21.27 9.53,19.21 IC1.4 | 10.16,21.91 v7.62,21.91
  Bottom 0.127: v42.23,5.56 42.39,5.4 42.39,2.38 42.55,2.22 U$3.P62 | JP1.57 7.62,17.14 v7.62,21.91
D3  (via drill 0.25)
  Top 0.127: v43.34,6.83 41.59,6.83 40.64,7.78 v37.62,7.78 | v11.59,10.64 11.11,11.11 6.03,11.11 JP1.58 | v10.79,21.91 10.79,19.21 IC1.5
  Bottom 0.127: v43.34,6.83 43.34,2.22 U$3.P61 | v37.62,7.78 36.04,9.37 11.59,9.37 v11.59,10.64 | v10.79,21.91 7.94,19.05 7.94,16.35 6.03,14.45 6.03,13.02 JP1.58
D4  (via drill 0.25)
  Top 0.127: v40.32,9.05 32.38,9.05 v31.11,10.32 | v15.56,16.83 15.56,17.14 16.51,18.1 16.51,20.16 16.03,20.64 13.65,20.64 | 13.65,20.64 13.18,20.64 12.06,19.53 12.06,19.21 IC1.6 | 13.65,20.64 v12.38,21.91
  Bottom 0.127: v40.32,9.05 42.55,9.05 43.97,7.62 43.97,2.38 44.13,2.22 U$3.P60 | v31.11,10.32 14.76,10.32 14.76,11.11 14.13,11.75 14.13,15.4 v15.56,16.83 | JP1.55 8.26,15.24 8.26,17.78 v12.38,21.91
D5  (via drill 0.25)
  Top 0.127: v45.09,6.35 41.12,6.35 40.96,6.51 36.99,6.51 35.88,7.62 v32.38,7.62 | v12.06,16.83 13.34,18.1 13.34,19.05 IC1.7
  Bottom 0.127: v45.09,6.35 45.09,2.22 U$3.P59 | v32.38,7.62 26.83,7.62 25.88,8.57 9.21,8.57 | 9.21,8.57 8.89,8.57 8.89,2.86 8.1,2.06 6.67,2.06 6.67,11.11 JP1.56 | v12.06,16.83 10,16.83 10,15.88 9.21,15.08 9.21,8.57
D6  (via drill 0.25)
  Top 0.127: v45.72,6.99 43.81,6.99 43.18,7.62 42.55,7.62 41.75,8.41 v37.62,8.41 | v16.35,12.54 16.35,14.92 14.61,16.67 14.61,19.05 IC1.8
  Route15 0.127: JP1.53 10.16,13.49 11.75,11.91 11.75,11.59 12.22,11.11 15.72,11.11 16.35,11.75 v16.35,12.54
  Bottom 0.127: v45.72,6.99 45.72,2.22 U$3.P58 | v37.62,8.41 35.24,10.79 16.35,10.79 v16.35,12.54
D7  (via drill 0.25)
  Top 0.127: v43.02,17.94 42.39,17.94 v40.64,19.68 | JP1.54 11.11,13.02 12.54,13.02 13.97,14.45 13.97,20.16 14.13,20.32 15.08,20.32 15.88,19.53 15.88,19.21 IC1.9
  Bottom 0.127: v43.02,17.94 43.02,17.46 44.13,16.35 44.13,9.84 46.67,7.3 46.67,2.22 U$3.P57 | v40.64,19.68 38.89,21.43 38.89,21.75 37.62,23.02 17.62,23.02 17.62,20.95 11.11,14.45 11.11,13.02 JP1.54
DATA_OUT  (via drill 0.25)
  Top 0.127: v36.51,2.86 36.67,2.7 36.67,1.27 36.99,0.95 40.16,0.95 40.64,1.43 40.64,2.06 U$3.P30 | JP2.2 85.41,13.02 85.41,14.45 81.92,17.94 81.92,20.16 81.76,20.32 79.53,20.32 78.74,19.53 78.74,19.21 U$5.20
  Route2 0.127: v36.51,2.86 62.39,2.86 68.9,9.37 v72.55,9.37
  Bottom 0.127: v72.55,9.37 74.3,11.11 86.36,11.11 JP2.2
GND  (via drill 0.25)
  Top 0.127: v40.16,5.4 36.83,5.4 36.04,6.19 33.34,6.19 31.27,4.13 31.27,3.33 U$3.PGB2 31.11,3.33 v29.05,3.33 29.05,5.4 23.34,11.11 18.26,11.11 | 18.73,19.05 22.86,19.05 U$1.13 | 18.73,19.05 17.14,19.05 IC1.10 17.14,19.21 v17.14,21.91 | U$6.2 15.24,8.1 18.26,11.11 | 18.26,11.11 18.73,11.59 18.73,19.05 | U$4.12 46.35,29.05 46.2,28.89 37.47,28.89 37.31,29.05 36.83,29.05 U$1.1 36.83,29.21 36.83,30.16 35.72,31.27 20.8,31.27 | 6.99,27.3 2.54,22.86 2.54,22.23 C3.2 | 6.99,27.3 6.99,29.05 IC1.19 | 20.8,29.05 18.73,29.05 16.99,27.3 | 20.8,29.05 22.86,29.05 U$1.12 | 6.99,27.3 16.99,27.3 | U$2.P$2 15.24,40.64 20.8,35.08 20.8,31.27 | 20.8,29.05 20.8,31.27 | 16.99,27.3 v16.99,23.5 | U$4.1 60.33,29.21 69.85,29.21 U$5.12 69.85,29.05 69.85,28.26 70.48,27.62 77.63,27.62 78.11,28.1 78.11,30.16 78.74,30.8 82.55,30.8 83.82,29.53 83.82,29.21 U$5.1 83.82,29.05 87,25.88 87,25.08 | 87,25.08 87,24.92 C2.2 87,25.08 | 88.9,25.08 96.84,25.08 JOY1_IN.6 | 88.9,25.08 87,25.08 | 88.9,25.08 U$2.P$44 | 46.35,21.91 43.34,24.92 40.01,24.92 C4.2 40.01,24.77 39.05,23.81 v38.42,23.81 | 46.35,21.91 46.35,19.21 U$4.13 | 63.5,24.77 64.29,24.77 69.85,19.21 U$5.13 69.85,19.05 v69.85,17.14 | 63.5,24.77 C1.2 63.5,24.77 | 46.35,21.91 48.26,21.91 51.12,24.77 63.5,24.77 | v72.55,3.33 70.48,3.33 U$3.PGT1
  Bottom 0.127: v40.16,5.4 40.16,2.22 U$3.P65 | v29.05,3.33 31.11,3.33 U$3.PGB2 | v17.14,21.91 16.99,22.07 v16.99,23.5 38.42,23.5 v38.42,23.81 | JOY1_IN.6 103.19,24.13 103.19,23.65 103.66,23.18 105.25,23.18 | 105.25,23.18 106.68,23.18 JOY1_OUT.6 | 105.25,9.84 106.68,9.84 JOY2_OUT.6 | 105.25,9.84 103.66,9.84 103.19,9.37 103.19,8.89 JOY2_IN.6 97.79,9.84 87.79,9.84 84.14,6.19 84.14,1.43 77.63,1.43 77.15,1.91 77.15,3.33 v72.55,3.33 70.48,3.33 U$3.PGT1 70.33,3.33 70.33,7.78 70.17,7.94 70.17,16.83 v69.85,17.14 | 105.25,9.84 105.25,23.18
HALT  (via drill 0.25)
  Top 0.127: v30.64,17.3 29.05,17.3 28.73,16.99 27.15,16.99 25.4,18.73 25.4,19.05 U$1.15
  Route2 0.127: v48.1,10.64 46.67,12.06 46.67,12.54 45.56,13.65 45.24,13.65 44.45,14.45 44.45,15.24 43.66,16.03 41.59,16.03 40.32,17.3 v30.64,17.3
  Route15 0.127: JP1.52 13.02,12.06 14.61,13.65 23.34,13.65 24.45,14.76 24.45,15.08 26.35,16.99 30.32,16.99 v30.64,17.3
  Bottom 0.127: v48.1,10.64 48.1,2.22 U$3.P55
J1_1  (via drill 0.25)
  Top 0.127: JOY1_IN.1 96.36,29.21 97.31,30.16 103.19,30.16 JOY1_OUT.1 | JP1.19 52.39,13.65 52.39,9.68 47.94,5.24 47.94,2.22 U$3.P21
  Route15 0.127: JOY1_IN.1 93.98,27.94 93.03,27.94 85.72,20.64 71.91,20.64 v69.37,23.18
  Bottom 0.127: v69.37,23.18 50.8,23.18 50.8,17.46 53.34,14.92 JP1.19
J1_2
  Top 0.127: JP1.20 53.02,11.75 53.02,9.84 48.74,5.56 48.74,2.22 U$3.P20
  Route15 0.127: JOY1_IN.2 96.68,29.21 95.09,27.62 93.19,27.62 85.25,19.68 60.8,19.68 57.31,16.19 56.04,16.19 54.29,14.45 54.29,13.02 JP1.20
  Bottom 0.127: JOY1_IN.2 103.19,29.21 103.19,29.69 103.66,30.16 106.68,30.16 JOY1_OUT.2
J1_3
  Top 0.127: JP1.17 54.93,13.65 54.93,11.27 49.53,5.87 49.53,2.22 U$3.P19
  Route15 0.127: JOY1_IN.3 92.71,26.67 85.41,19.37 62.23,19.37 58.74,15.88 57.15,15.88 JP1.17
  Bottom 0.127: JOY1_IN.3 96.84,28.26 104.14,28.26 JOY1_OUT.3
J1_4
  Top 0.127: JP1.18 55.88,11.75 50.32,6.19 50.32,2.22 U$3.P18
  Route15 0.127: JOY1_IN.5 93.98,24.13 88.9,19.05 65.88,19.05 62.39,15.56 57.94,15.56 56.83,14.45 56.83,13.02 JP1.18
  Bottom 0.127: JOY1_IN.5 96.84,24.13 96.84,24.61 97.31,25.08 104.14,25.08 JOY1_OUT.5
J1_5
  Top 0.127: JOY1_IN.7 96.36,21.59 97.31,22.54 103.19,22.54 JOY1_OUT.7 | JP1.15 57.47,13.65 57.47,12.22 51.12,5.87 51.12,2.22 U$3.P17
  Route2 0.127: JOY1_IN.7 90.96,21.59 88.74,19.37 63.18,19.37 JP1.15
J1_A1
  Top 0.127: JOY1_IN.8 102.71,21.59 103.66,20.64 105.73,20.64 JOY1_OUT.8 | JP1.16 51.91,5.56 51.91,2.22 U$3.P16
  Route2 0.127: JOY1_IN.8 96.68,21.59 95.09,20 94.77,20 94.3,19.53 94.3,18.57 93.66,17.94 69.22,17.94 67.47,16.19 61.12,16.19 59.37,14.45 59.37,13.02 JP1.16
J1_A2
  Top 0.127: JOY1_IN.9 96.36,19.05 97.31,20 103.19,20 JOY1_OUT.9 | JP1.13 60.01,13.65 60.01,12.22 58.9,11.11 58.58,11.11 52.7,5.24 52.7,2.22 U$3.P15
  Route2 0.127: JOY1_IN.9 93.82,17.62 69.53,17.62 67.79,15.88 62.23,15.88 JP1.13
J2_1  (via drill 0.25)
  Top 0.127: JOY2_OUT.1 103.19,13.02 97.31,13.02 96.36,13.97 JOY2_IN.1 89.69,13.97 86.36,10.64 72.87,10.64 v69.85,7.62 | JP1.8 65.88,9.37 62.07,9.37 58.26,5.56 58.26,2.22 U$3.P8
  Bottom 0.127: v69.85,7.62 68.58,8.89 JP1.8
J2_2
  Top 0.127: JOY2_IN.2 102.71,13.97 103.66,14.92 105.73,14.92 JOY2_OUT.2 | JP1.7 67.63,13.65 67.63,12.22 65.09,9.68 61.91,9.68 57.47,5.24 57.47,2.22 U$3.P9
  Route2 0.127: JOY2_IN.2 94.46,17.3 71.28,17.3 JP1.7
J2_3  (via drill 0.25)
  Top 0.127: JOY2_IN.3 96.36,11.43 97.31,10.48 103.19,10.48 JOY2_OUT.3 | JP1.10 63.98,10 61.75,10 56.67,4.92 56.67,2.22 U$3.P10
  Route15 0.127: v74.3,10.16 67.94,10.16 JP1.10
  Bottom 0.127: JOY2_IN.3 87.15,11.43 85.88,10.16 v74.3,10.16
J2_4
  Top 0.127: JP1.9 65.09,13.65 65.09,12.22 63.98,11.11 62.39,11.11 55.88,4.6 55.88,2.22 U$3.P11
  Route15 0.127: JOY2_IN.5 94.77,8.89 91.92,11.75 88.11,11.75 86.2,13.65 66.99,13.65 JP1.9
  Bottom 0.127: JOY2_IN.5 96.84,7.3 104.14,7.3 JOY2_OUT.5
J2_5
  Top 0.127: JOY2_IN.7 96.36,6.35 97.31,7.3 103.19,7.3 JOY2_OUT.7 | JP1.12 62.87,12.06 55.09,4.29 55.09,2.22 U$3.P12
  Route15 0.127: JOY2_IN.7 89.06,6.35 87.15,8.26 67.31,8.26 JP1.12
J2_A1
  Top 0.127: JP1.11 62.55,13.65 62.55,12.22 54.29,3.97 54.29,2.22 U$3.P13
  Route2 0.127: JOY2_IN.8 97.79,7.46 96.2,9.05 96.2,9.37 95.41,10.16 76.68,10.16 74.61,12.22 74.61,12.54 73.5,13.65 64.45,13.65 JP1.11
  Bottom 0.127: JOY2_IN.8 103.19,6.35 103.19,5.87 103.66,5.4 106.68,5.4 JOY2_OUT.8
J2_A2
  Top 0.127: JP1.14 53.5,4.6 53.5,2.22 U$3.P14
  Route2 0.127: JOY2_IN.9 91.92,3.81 87.15,8.57 75.25,8.57 72.07,11.75 72.07,12.54 71.6,13.02 61.91,13.02 JP1.14
  Bottom 0.127: JOY2_IN.9 96.84,2.22 104.14,2.22 JOY2_OUT.9
MTR_CTRL
  Top 0.127: 80.01,13.65 82.87,13.65 JP2.3 | 80.01,13.65 73.82,13.65 72.71,12.54 72.71,12.22 71.6,11.11 70.64,11.11 64.77,5.24 64.77,0.95 64.45,0.64 42.23,0.64 41.59,1.27 41.59,2.06 U$3.P29 | 80.01,13.65 80.01,19.05 U$5.21
N$1  (via drill 0.25)
  Top 0.127: v24.13,26.83 24.13,29.05 U$1.11 | v42.7,37.15 46.35,37.15 47.47,38.26 47.47,45.88 45.72,47.62 U$2.P$14
  Bottom 0.127: v24.13,26.83 37.15,26.83 37.15,31.59 v42.7,37.15
N$3  (via drill 0.25)
  Top 0.127: v38.1,25.72 28.42,25.72 25.4,28.73 25.4,29.05 U$1.10 | v72.07,31.11 73.34,32.38 73.34,39.85 78.74,45.24 U$2.P$40
  Route2 0.127: v38.1,25.72 42.07,25.72 42.55,26.19 67.15,26.19 v72.07,31.11
N$4  (via drill 0.25)
  Top 0.127: v37.62,26.51 28.89,26.51 26.67,28.73 26.67,29.05 U$1.9
  Route2 0.127: v37.62,26.51 66.83,26.51 v72.07,31.75
  Bottom 0.127: v72.07,31.75 76.2,35.88 U$2.P$32
N$5  (via drill 0.25)
  Top 0.127: v40.64,26.99 29.69,26.99 27.94,28.73 27.94,29.05 U$1.8
  Route15 0.127: v40.64,26.99 41.43,26.19 68.42,26.19 v73.03,30.8
  Bottom 0.127: v73.03,30.8 78.74,36.51 U$2.P$33
N$6  (via drill 0.25)
  Top 0.127: v29.21,30.8 29.21,29.21 U$1.7 | v34.92,33.34 44.45,33.34 48.26,37.15 U$2.P$15
  Bottom 0.127: v29.21,30.8 31.75,33.34 v34.92,33.34
N$7  (via drill 0.25)
  Top 0.127: v43.66,27.94 31.27,27.94 30.48,28.73 30.48,29.05 U$1.6
  Route15 0.127: v43.66,27.94 48.74,27.94 50.16,26.51 68.1,26.51 v82.87,41.27
  Bottom 0.127: v82.87,41.27 86.36,44.77 U$2.P$36
N$8  (via drill 0.25)
  Top 0.127: v30.48,30.8 31.75,29.53 31.75,29.21 U$1.5
  Route15 0.127: v20.95,40.32 v30.48,30.8
  Bottom 0.127: v20.95,40.32 15.24,46.04 12.7,46.04 U$2.P$16
N$9  (via drill 0.25)
  Top 0.127: v33.02,30.8 33.02,29.21 U$1.4
  Bottom 0.127: v33.02,30.8 40.64,38.42 U$2.P$27
N$10  (via drill 0.25)
  Top 0.127: v34.29,30.8 34.29,29.21 U$1.3
  Route15 0.127: v46.51,45.88 v42.7,42.07
  Bottom 0.127: v34.29,30.8 42.7,39.21 v42.7,42.07 | v46.51,45.88 48.26,47.62 U$2.P$30
N$11  (via drill 0.25)
  Top 0.127: v35.56,30.8 35.56,29.21 U$1.2
  Route15 0.127: v35.56,30.8 35.56,32.07 v24.13,43.5
  Bottom 0.127: v24.13,43.5 22.86,44.77 U$2.P$20
N$22  (via drill 0.25)
  Top 0.127: v45.24,26.99 45.88,26.99 47.62,28.73 47.62,29.05 U$4.11
  Route15 0.127: v45.24,26.99 42.23,26.99 v21.59,47.62
  Bottom 0.127: U$2.P$19 v21.59,47.62
N$23  (via drill 0.25)
  Top 0.127: v38.26,29.37 39.37,30.48 47.94,30.48 48.9,29.53 48.9,29.21 U$4.10
  Route15 0.127: v38.26,29.37 37.31,30.32 35.4,30.32 v23.18,42.55
  Bottom 0.127: v23.18,42.55 19.68,46.04 17.78,46.04 U$2.P$18
N$24  (via drill 0.25)
  Top 0.127: v37.62,29.37 39.05,30.8 48.9,30.8 50.16,29.53 50.16,29.21 U$4.9
  Route15 0.127: v37.62,29.37 33.5,29.37 v21.75,41.12
  Bottom 0.127: v21.75,41.12 15.24,47.62 U$2.P$17
N$25  (via drill 0.25)
  Top 0.127: v46.51,26.99 49.69,26.99 51.44,28.73 51.44,29.05 U$4.8 | v36.67,31.59 32.07,31.59 17.78,45.88 U$2.P$3
  Route15 0.127: v46.51,26.99 45.88,26.99 45.4,26.51 41.75,26.51 v36.67,31.59
N$26
  Top 0.127: U$2.P$4 20.32,44.77 32.86,32.23 47.15,32.23 48.1,31.27 50.96,31.27 52.7,29.53 52.7,29.21 U$4.7
N$27  (via drill 0.25)
  Top 0.127: v61.28,30.48 60.96,30.8 55.24,30.8 53.98,29.53 53.98,29.21 U$4.6 | v42.23,35.72 34.77,35.72 22.86,47.62 U$2.P$5
  Route2 0.127: v61.28,30.48 47.47,30.48 v42.23,35.72
N$28  (via drill 0.25)
  Top 0.127: v58.42,26.99 58.42,30.16 58.1,30.48 56.2,30.48 55.24,29.53 55.24,29.21 U$4.5 | v46.51,36.04 43.18,36.04 36.99,42.23 30.8,42.23 25.4,47.62 U$2.P$6
  Bottom 0.127: v58.42,26.99 54.45,30.96 46.51,30.96 v46.51,36.04
N$29  (via drill 0.25)
  Top 0.127: v50.32,26.99 54.77,26.99 56.52,28.73 56.52,29.05 U$4.4 | v34.61,42.7 32.86,42.7 27.94,47.62 U$2.P$7
  Route15 0.127: v34.61,42.7 v50.32,26.99
N$30  (via drill 0.25)
  Top 0.127: v44.13,27.46 45.09,26.51 55.56,26.51 57.78,28.73 57.78,29.05 U$4.3 | v43.66,39.37 40.96,39.37 35.72,44.61 33.5,44.61 30.48,47.62 U$2.P$8
  Bottom 0.127: v44.13,27.46 44.13,38.89 v43.66,39.37
N$31  (via drill 0.25)
  Top 0.127: v59.05,26.99 59.05,29.05 U$4.2 | v46.99,38.42 46.99,43.81 43.18,47.62 U$2.P$13
  Bottom 0.127: v59.05,26.99 54.77,31.27 46.99,31.27 v46.99,38.42
N$42  (via drill 0.25)
  Top 0.127: v61.28,29.84 61.91,30.48 70.17,30.48 70.48,30.16 70.48,28.1 70.64,27.94 76.68,27.94 77.47,28.73 77.47,29.05 U$5.6
  Route2 0.127: v61.28,29.84 26.51,29.84 11.11,14.45 11.11,9.84 U$6.6
N$43
  Top 0.127: U$6.5 0.95,10.48 0.95,16.51 7.46,23.02 36.83,23.02 38.42,24.61 38.42,25.4 39.21,26.19 78.74,26.19 80.64,28.1 80.64,30.16 80.33,30.48 79.69,30.48 78.74,29.53 78.74,29.21 U$5.5
N$44  (via drill 0.25)
  Top 0.127: v56.67,26.99 57.15,26.51 77.79,26.51 80.01,28.73 80.01,29.05 U$5.4
  Route2 0.127: v56.67,26.99 50.96,26.99 49.53,28.42 26.51,28.42 13.65,15.56 13.65,4.76 U$6.3
N$45  (via drill 0.25)
  Top 0.127: v70.48,30.8 71.12,30.16 71.12,29.21 U$5.11 | v45.4,38.89 45.4,42.86 40.64,47.62 U$2.P$12
  Route2 0.127: v70.48,30.8 62.55,30.8 62.23,30.48 61.91,30.48 61.12,31.27 50.64,31.27 45.4,36.51 v45.4,38.89
N$46  (via drill 0.25)
  Top 0.127: v62.07,30.96 62.39,31.27 70.64,31.27 72.39,29.53 72.39,29.21 U$5.10 | U$2.P$9 v34.29,47.62
  Route15 0.127: v62.07,30.96 50.96,30.96 v34.29,47.62
N$47
  Top 0.127: U$2.P$41 81.28,47.31 73.66,39.69 73.66,29.21 U$5.9
N$48
  Top 0.127: U$2.P$42 83.82,47.62 74.93,38.73 74.93,29.21 U$5.8
N$49
  Top 0.127: U$2.P$43 86.36,47.62 76.2,37.47 76.2,29.21 U$5.7
N$67  (via drill 0.25)
  Top 0.127: v20.32,34.92 17.14,31.75 17.14,29.21 IC1.11 | v33.66,45.09 35.56,45.09 38.1,47.62 U$2.P$11
  Bottom 0.127: v20.32,34.92 30.48,45.09 v33.66,45.09
N$68  (via drill 0.25)
  Top 0.127: v15.88,32.07 15.88,29.21 IC1.12
  Bottom 0.127: v15.88,32.07 30,32.07 38.1,40.16 U$2.P$26
N$69  (via drill 0.25)
  Top 0.127: v19.21,36.04 14.61,31.43 14.61,29.21 IC1.13
  Route15 0.127: v19.21,37.31 v19.21,36.04
  Bottom 0.127: v19.21,37.31 27.94,46.04 U$2.P$22
N$70  (via drill 0.25)
  Top 0.127: v17.78,35.4 13.34,30.96 13.34,29.21 IC1.14
  Bottom 0.127: v17.78,35.4 18.41,36.04 18.41,37.15 25.4,44.13 U$2.P$21
N$71  (via drill 0.25)
  Top 0.127: v17.14,37.47 17.14,35.24 12.06,30.16 12.06,29.21 IC1.15 | v34.29,48.58 35.24,48.58 U$2.P$10
  Route2 0.127: v17.14,37.47 28.26,48.58 v34.29,48.58
N$72  (via drill 0.25)
  Top 0.127: v16.19,34.92 10.79,29.53 10.79,29.21 IC1.16
  Bottom 0.127: v16.19,34.92 18.73,34.92 18.73,36.2 28.57,46.04 30.48,46.04 U$2.P$23
N$73  (via drill 0.25)
  Top 0.127: v17.14,38.1 9.53,30.48 9.53,29.21 IC1.17
  Route15 0.127: v17.14,38.1 17.14,43.81 21.43,48.1 v31.75,48.1
  Bottom 0.127: v31.75,48.1 33.02,48.1 U$2.P$24
N$74  (via drill 0.25)
  Top 0.127: v8.26,27.78 8.26,29.05 IC1.18
  Bottom 0.127: v8.26,27.78 14.92,34.45 31.91,34.45 31.91,42.7 35.56,46.35 U$2.P$25
RD4  (via drill 0.25)
  Top 0.127: v47.15,6.99 44.77,4.6 44.77,2.22 U$3.P25 | v12.7,41.43 U$2.P$1
  Bottom 0.127: v47.15,6.99 47.31,7.14 47.31,13.65 JP1.23 48.26,15.24 46.67,16.83 46.67,22.07 44.93,22.07 42.7,24.29 42.7,25.24 10.16,25.24 7.78,27.62 7.78,27.94 10.64,30.8 10.64,39.37 v12.7,41.43
RD5  (via drill 0.25)
  Top 0.127: v46.2,5.4 45.56,4.76 45.56,2.22 U$3.P24
  Route15 0.127: v46.2,5.4 46.2,10 JP1.24
  Bottom 0.127: U$2.P$29 46.04,48.58 46.04,23.18 49.21,20 49.21,13.97 48.26,13.02 JP1.24
REF  (via drill 0.25)
  Top 0.127: v51.28,9.21 47.15,9.21 v45.88,10.48 | v45.24,17.14 44.93,17.14 44.13,16.35 32.86,16.35 | 32.86,16.35 30.48,18.73 30.48,19.05 U$1.19 | 32.86,16.35 v28.26,16.35
  Bottom 0.127: v51.28,9.21 51.28,2.22 U$3.P51 | v45.88,10.48 44.77,11.59 44.77,16.67 v45.24,17.14 | JP1.48 19.37,12.06 19.37,11.59 19.84,11.11 26.99,11.11 26.99,15.08 v28.26,16.35
RST  (via drill 0.25)
  Top 0.127: v23.18,22.54 23.65,22.54 26.67,19.53 26.67,19.21 U$1.16
  Route15 0.127: v46.67,23.18 23.81,23.18 v23.18,22.54 JP1.49
  Bottom 0.127: v46.67,23.18 49.53,20.32 49.53,13.81 49.21,13.49 49.21,2.38 49.05,2.22 U$3.P54
RW  (via drill 0.25)
  Top 0.127: JP1.51 11.75,13.65 2.06,13.65 1.59,14.13 1.59,15.08 2.06,15.56 2.22,15.56 5.71,19.05 IC1.1 | v40.16,10.79 30.32,10.79 28.89,12.22 28.89,15.08 27.3,16.67 26.19,16.67 25.56,17.3 | 25.56,17.3 24.13,18.73 24.13,19.05 U$1.14 | 25.56,17.3 v20.48,17.3
  Route2 0.127: v47.15,6.03 46.04,6.03 41.27,10.79 v40.16,10.79
  Bottom 0.127: v47.15,6.03 47.15,2.38 47.31,2.22 U$3.P56 | JP1.51 15.4,17.3 v20.48,17.3
S4  (via drill 0.25)
  Top 0.127: v33.02,16.83 31.75,18.1 31.75,19.05 U$1.20
  Route2 0.127: v51.28,9.84 50.64,9.84 50.32,9.53 46.2,9.53 44.13,11.59 44.13,15.08 43.5,15.72 41.43,15.72 41.27,15.88 33.02,15.88 | 33.02,15.88 21.59,15.88 JP1.45 | 33.02,15.88 v33.02,16.83
  Bottom 0.127: v51.28,9.84 51.91,9.21 51.91,2.38 52.07,2.22 U$3.P50
S5  (via drill 0.25)
  Top 0.127: v44.13,16.99 34.77,16.99 33.02,18.73 33.02,19.05 U$1.21 33.02,19.21 33.02,19.53 31.27,21.27 v28.1,21.27
  Route15 0.127: v51.75,15.24 50.32,16.67 44.45,16.67 v44.13,16.99
  Bottom 0.127: v51.75,15.24 51.75,11.11 52.7,10.16 52.7,2.38 52.86,2.22 U$3.P49 | JP1.46 21.91,13.65 21.91,15.08 v28.1,21.27
SIO_CLK_IN  (via drill 0.25)
  Top 0.127: v50.8,8.73 50.8,8.57 47.15,4.92 47.15,2.22 U$3.P22
  Route2 0.127: U$6.7 3.97,2.38 13.18,2.38 14.29,3.49 14.29,5.08 15.56,6.35 15.56,10.95 16.83,12.22 16.83,15.08 20.16,18.41 43.34,18.41 45.09,16.67 47.62,16.67 49.85,14.45 49.85,13.02 JP1.22
  Bottom 0.127: JP1.22 v50.8,8.73
SIO_DATA_IN
  Top 0.127: JP1.21 49.21,13.02 49.21,11.59 48.74,11.11 45.88,11.11 45.4,10.64 45.4,10.32 47.62,8.1 47.62,5.87 46.35,4.6 46.35,2.22 U$3.P23
  Route15 0.127: U$6.4 10.16,6.83 9.53,7.46 9.53,8.1 11.11,9.68 32.07,9.68 34.61,12.22 34.61,12.54 35.72,13.65 36.04,13.65 37.15,14.76 37.15,15.08 38.1,16.03 49.37,16.03 JP1.21

### Text on the board
tPlace: PIO v1 / (c) 2018 SjG